# EAGLE design tally (EAGLE 9.6.2)
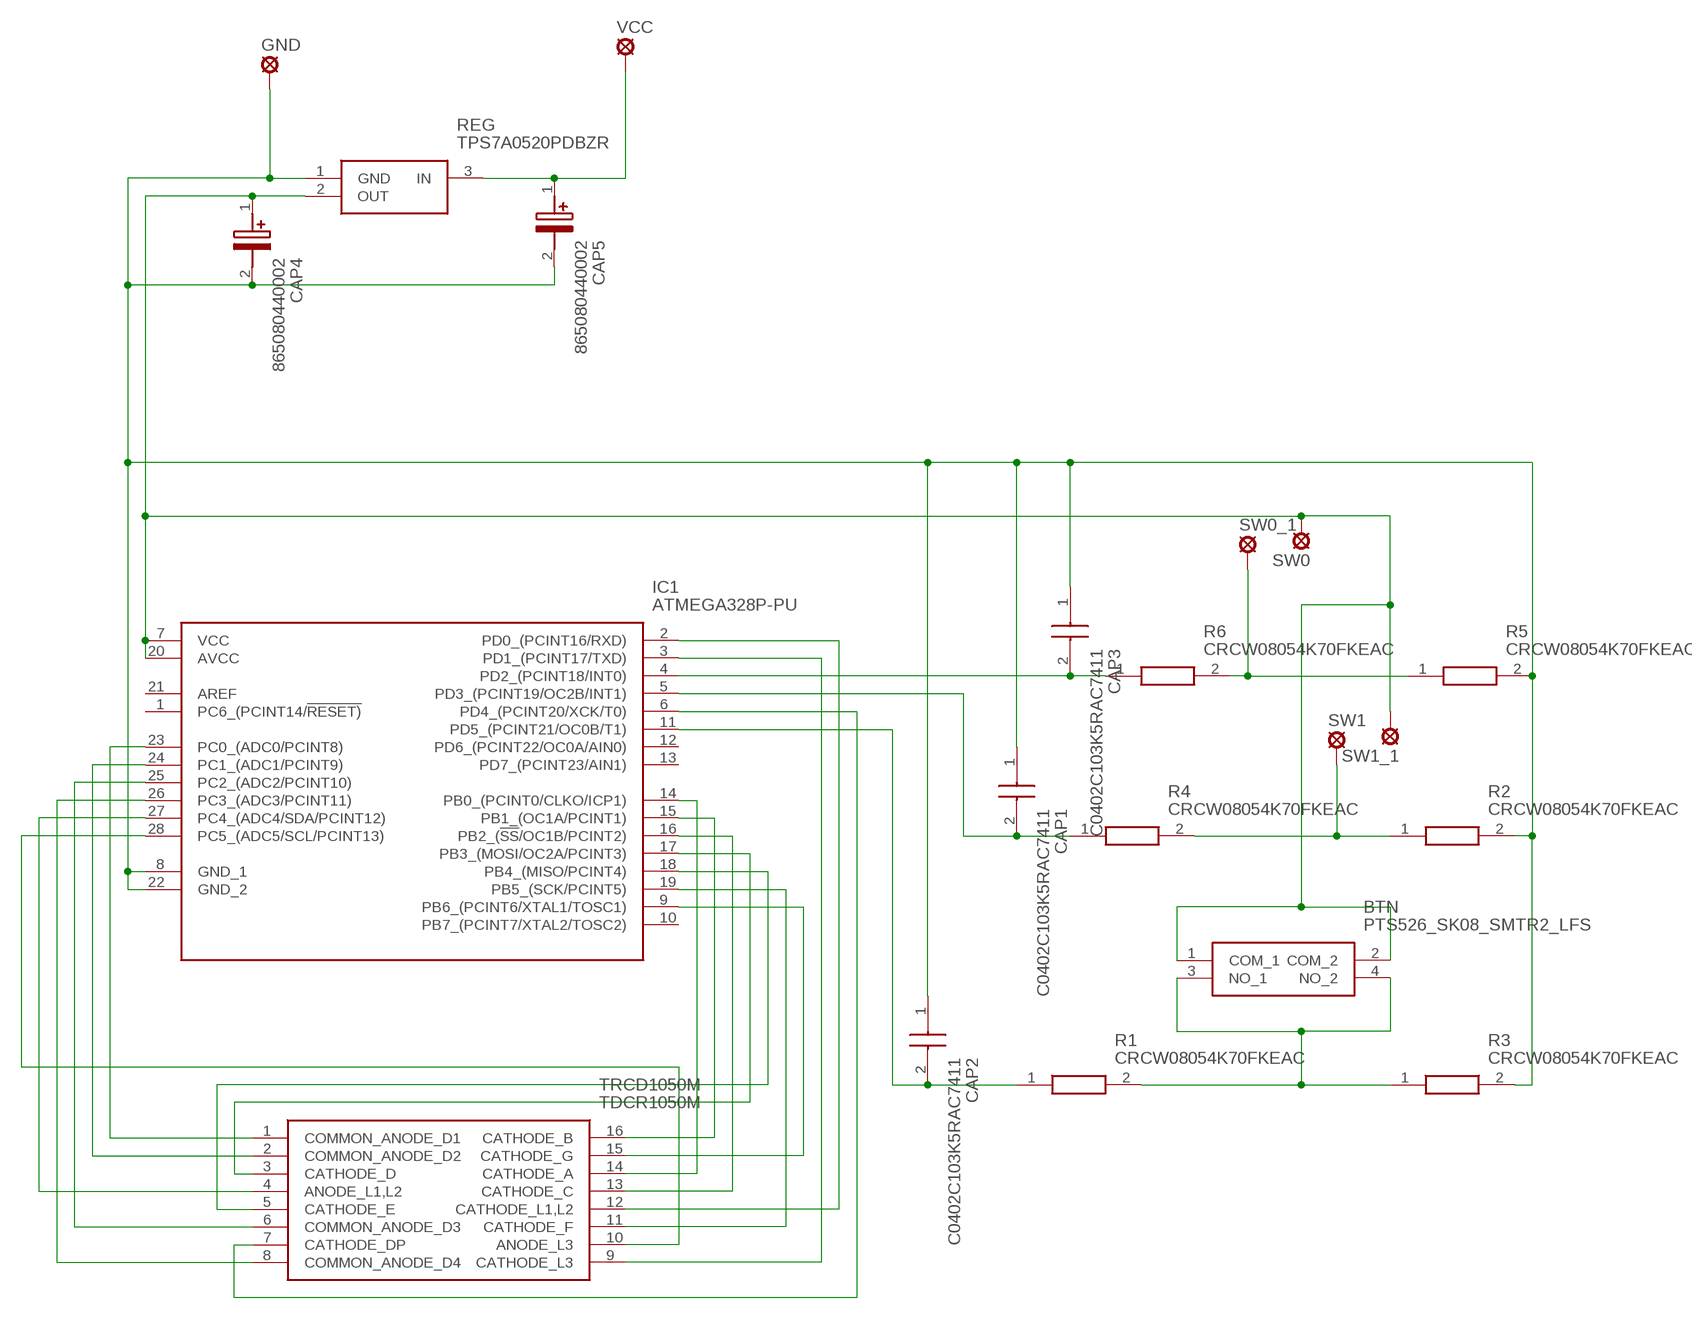
[diagram p0: schematic, sheet 1]

## Parts
BTN  PTS526_SK08_SMTR2_LFS  [PTS526SKG15SMTR2LFS]
CAP1  C0402C103K5RAC7411  [CAPC1005X55N]
CAP2  C0402C103K5RAC7411  [CAPC1005X55N]
CAP3  C0402C103K5RAC7411  [CAPC1005X55N]
CAP4  865080440002  [CAPAE400X550N]
CAP5  865080440002  [CAPAE400X550N]
GND  LSP11  [LSP11]
IC1  ATMEGA328P-PU  [DIP794W53P254L3467H457Q28N]
R1  CRCW08054K70FKEAC  [RESC2012X60N]
R2  CRCW08054K70FKEAC  [RESC2012X60N]
R3  CRCW08054K70FKEAC  [RESC2012X60N]
R4  CRCW08054K70FKEAC  [RESC2012X60N]
R5  CRCW08054K70FKEAC  [RESC2012X60N]
R6  CRCW08054K70FKEAC  [RESC2012X60N]
REG  TPS7A0520PDBZR  [SOT95P237X112-3N]
SW0  LSP11  [LSP11]
SW0_1  LSP11  [LSP11]
SW1  LSP11  [LSP11]
SW1_1  LSP11  [LSP11]
TRCD1050M  TDCR1050M  [DIPS1016W50P254L4020H725Q16N]
VCC  LSP11  [LSP11]

## Nets
N$1: CAP1.1 CAP2.1 CAP3.1 CAP4.2(-) CAP5.2(-) GND.MP IC1.8(GND_1) IC1.22(GND_2) R2.2 R3.2 R5.2 REG.1(GND)
N$2: CAP5.1(+) REG.3(IN) VCC.MP
N$4: IC1.14(PB0_(PCINT0/CLKO/ICP1)) TRCD1050M.14(CATHODE_A)
N$5: IC1.15(PB1_(OC1A/PCINT1)) TRCD1050M.16(CATHODE_B)
N$6: IC1.16(PB2_(!SS!/OC1B/PCINT2)) TRCD1050M.13(CATHODE_C)
N$7: IC1.17(PB3_(MOSI/OC2A/PCINT3)) TRCD1050M.3(CATHODE_D)
N$8: IC1.18(PB4_(MISO/PCINT4)) TRCD1050M.5(CATHODE_E)
N$9: IC1.19(PB5_(SCK/PCINT5)) TRCD1050M.11(CATHODE_F)
N$10: IC1.9(PB6_(PCINT6/XTAL1/TOSC1)) TRCD1050M.15(CATHODE_G)
N$11: IC1.23(PC0_(ADC0/PCINT8)) TRCD1050M.1(COMMON_ANODE_D1)
N$12: IC1.24(PC1_(ADC1/PCINT9)) TRCD1050M.2(COMMON_ANODE_D2)
N$13: IC1.25(PC2_(ADC2/PCINT10)) TRCD1050M.6(COMMON_ANODE_D3)
N$14: IC1.26(PC3_(ADC3/PCINT11)) TRCD1050M.8(COMMON_ANODE_D4)
N$15: IC1.27(PC4_(ADC4/SDA/PCINT12)) TRCD1050M.4(ANODE_L1,L2)
N$16: IC1.28(PC5_(ADC5/SCL/PCINT13)) TRCD1050M.10(ANODE_L3)
N$17: IC1.2(PD0_(PCINT16/RXD)) TRCD1050M.12(CATHODE_L1,L2)
N$18: IC1.3(PD1_(PCINT17/TXD)) TRCD1050M.9(CATHODE_L3)
N$19: IC1.6(PD4_(PCINT20/XCK/T0)) TRCD1050M.7(CATHODE_DP)
N$20: R5.1 R6.2 SW0_1.MP
N$21: CAP3.2 IC1.4(PD2_(PCINT18/INT0)) R6.1
N$22: CAP1.2 IC1.5(PD3_(PCINT19/OC2B/INT1)) R4.1
N$23: R2.1 R4.2 SW1.MP
N$24: CAP2.2 IC1.11(PD5_(PCINT21/OC0B/T1)) R1.1
N$26: BTN.1(COM_1) BTN.2(COM_2) CAP4.1(+) IC1.7(VCC) IC1.20(AVCC) REG.2(OUT) SW0.MP SW1_1.MP
N$27: BTN.3(NO_1) BTN.4(NO_2) R1.2 R3.1
Unconnected: IC1.1(PC6_(PCINT14/!RESET)) IC1.10(PB7_(PCINT7/XTAL2/TOSC2)) IC1.12(PD6_(PCINT22/OC0A/AIN0)) IC1.13(PD7_(PCINT23/AIN1)) IC1.21(AREF)

## Library data of the parts
BTN = SamacSys_Parts:PTS526_SK08_SMTR2_LFS: Tactile Switches 50mA 12VDC, 5.2x5.2mm, 0.8mm H, 260gf, G leads, No ground pin, no actuator Source: Datasheet <https://www.ckswitches.com/media/2780/pts526.pdf>; DESCRIPTION: Tactile Switches 50mA 12VDC, 5.2x5.2mm, 0.8mm H, 260gf, G leads, No ground pin, no actuator; HEIGHT: 1.6mm; MANUFACTURER_NAME: C & K COMPONENTS; MANUFACTURER_PART_NUMBER: PTS526 SK08 SMTR2 LFS; MOUSER_PART_NUMBER: 611-PTS526SK08SMTR2L; MOUSER_PRICE-STOCK: https://www.mouser.co.uk/ProductDetail/CK/PTS526-SK08-SMTR2-LFS?qs=UXgszm6BlbECw%2FyKtIWLXA%3D%3D
CAP1-CAP3 = SamacSys_Parts:C0402C103K5RAC7411: KEMET C0402C103K5RAC7411 10nF MLCC 50V dc +/-10% Tolerance SMD Source: Datasheet <https://ms.componentsearchengine.com/Datasheets/1/C0402C103K5RAC7411.pdf>; DESCRIPTION: KEMET C0402C103K5RAC7411 10nF MLCC 50V dc +/-10% Tolerance SMD; HEIGHT: 0.55mm; MANUFACTURER_NAME: Kemet; MANUFACTURER_PART_NUMBER: C0402C103K5RAC7411; MOUSER_PART_NUMBER: 80-C0402C103K5R7411; MOUSER_PRICE-STOCK: https://www.mouser.co.uk/ProductDetail/KEMET/C0402C103K5RAC7411?qs=pp%2FXe%252B1It%2FXjIsxZQe1n3w%3D%3D
CAP4 CAP5 = SamacSys_Parts:865080440002: Wurth Elektronik 10uF 25 V dc Aluminium Electrolytic Capacitor, WCAP-ASLI Series 2000h 4 (Dia.) x 5.35mm Source: Datasheet <https://katalog.we-online.com/pbs/datasheet/865080440002.pdf>; DESCRIPTION: Wurth Elektronik 10uF 25 V dc Aluminium Electrolytic Capacitor, WCAP-ASLI Series 2000h 4 (Dia.) x 5.35mm; HEIGHT: 5.5mm; MANUFACTURER_NAME: Wurth Elektronik; MANUFACTURER_PART_NUMBER: 865080440002; MOUSER_PART_NUMBER: 710-865080440002; MOUSER_PRICE-STOCK: https://www.mouser.co.uk/ProductDetail/Wurth-Elektronik/865080440002?qs=0KOYDY2FL2%2FXvxJ7qSnXzw%3D%3D
GND SW0 SW0_1 SW1 SW1_1 VCC = solpad:LSP11: SOLDER PAD drill 1.1 mm
IC1 = SamacSys_Parts:ATMEGA328P-PU: MICROCHIP - ATMEGA328P-PU. - MICROCONTROLLER MCU, 8 BIT, ATMEGA, 20MHZ, DIP-28 Source: Datasheet <http://ww1.microchip.com/downloads/en/DeviceDoc/Atmel-42735-8-bit-AVR-Microcontroller-ATmega328-328P_Datasheet.pdf>; DESCRIPTION: MICROCHIP - ATMEGA328P-PU. - MICROCONTROLLER MCU, 8 BIT, ATMEGA, 20MHZ, DIP-28; HEIGHT: 4.572mm; MANUFACTURER_NAME: Microchip; MANUFACTURER_PART_NUMBER: ATMEGA328P-PU; MOUSER_PART_NUMBER: 556-ATMEGA328P-PU; MOUSER_PRICE-STOCK: https://www.mouser.co.uk/ProductDetail/Microchip-Technology-Atmel/ATMEGA328P-PU?qs=K8BHR703ZXguOQv3sKbWcg%3D%3D
R1-R6 = SamacSys_Parts:CRCW08054K70FKEAC: Thick Film Resistors - SMD 1/8Watt 4.7Kohms 1% Commercial Use Source: Datasheet; DESCRIPTION: Thick Film Resistors - SMD 1/8Watt 4.7Kohms 1% Commercial Use; HEIGHT: 0.6mm; MANUFACTURER_NAME: Vishay; MANUFACTURER_PART_NUMBER: CRCW08054K70FKEAC; MOUSER_PART_NUMBER: 71-CRCW08054K70FKEAC; MOUSER_PRICE-STOCK: https://www.mouser.co.uk/ProductDetail/Vishay-Dale/CRCW08054K70FKEAC?qs=E3Y5ESvWgWOQAAVugewEHA%3D%3D
REG = SamacSys_Parts:TPS7A0520PDBZR: 1-A, ultra-low-IQ, 200-mA low-dropout (LDO) regulator in a small-sized package Source: Datasheet <https://www.ti.com/lit/gpn/TPS7A05>; DESCRIPTION: 1-A, ultra-low-IQ, 200-mA low-dropout (LDO) regulator in a small-sized package; HEIGHT: 1.12mm; MANUFACTURER_NAME: Texas Instruments; MANUFACTURER_PART_NUMBER: TPS7A0520PDBZR; MOUSER_PART_NUMBER: 595-TPS7A0520PDBZR; MOUSER_PRICE-STOCK: https://www.mouser.co.uk/ProductDetail/Texas-Instruments/TPS7A0520PDBZR?qs=XeJtXLiO41S12gnuxaHGgQ%3D%3D
TRCD1050M = SamacSys_Parts:TDCR1050M: LED Displays & Accessories 7-Seg Clock module 10mm red m.plex c.a. Source: Datasheet <https://www.vishay.com/docs/83180/tdcx10x0m.pdf>; DESCRIPTION: LED Displays & Accessories 7-Seg Clock module 10mm red m.plex c.a.; HEIGHT: 7.25mm; MANUFACTURER_NAME: Vishay; MANUFACTURER_PART_NUMBER: TDCR1050M; MOUSER_PART_NUMBER: 78-TDCR1050M; MOUSER_PRICE-STOCK: https://www.mouser.co.uk/ProductDetail/Vishay-Semiconductors/TDCR1050M?qs=RzxYCzJDjPVEfTEFPHCLeg%3D%3D

## Board
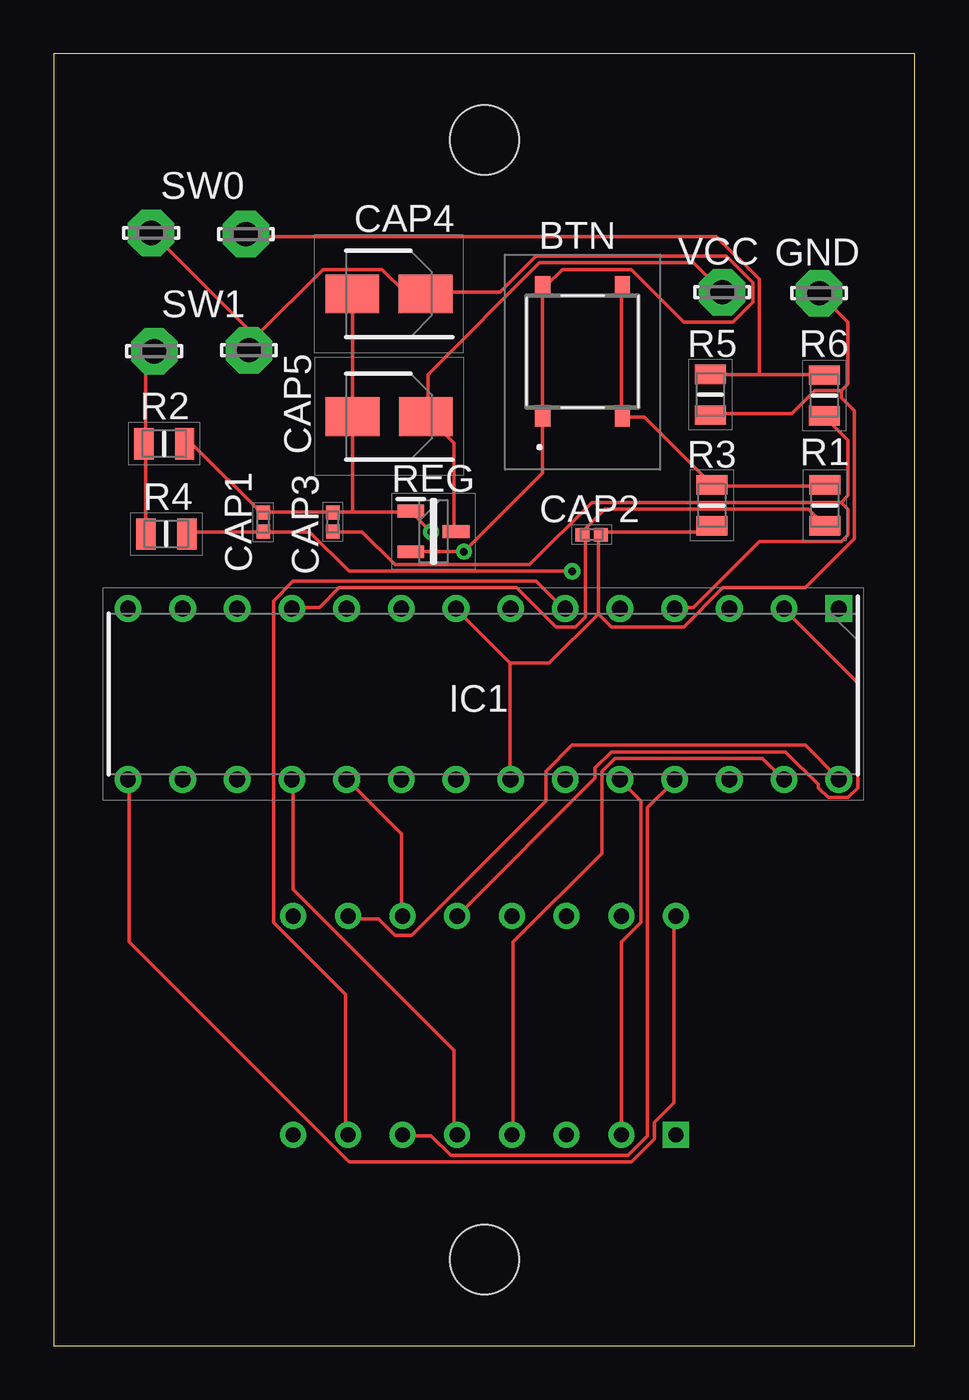
[diagram p1: board, top side]
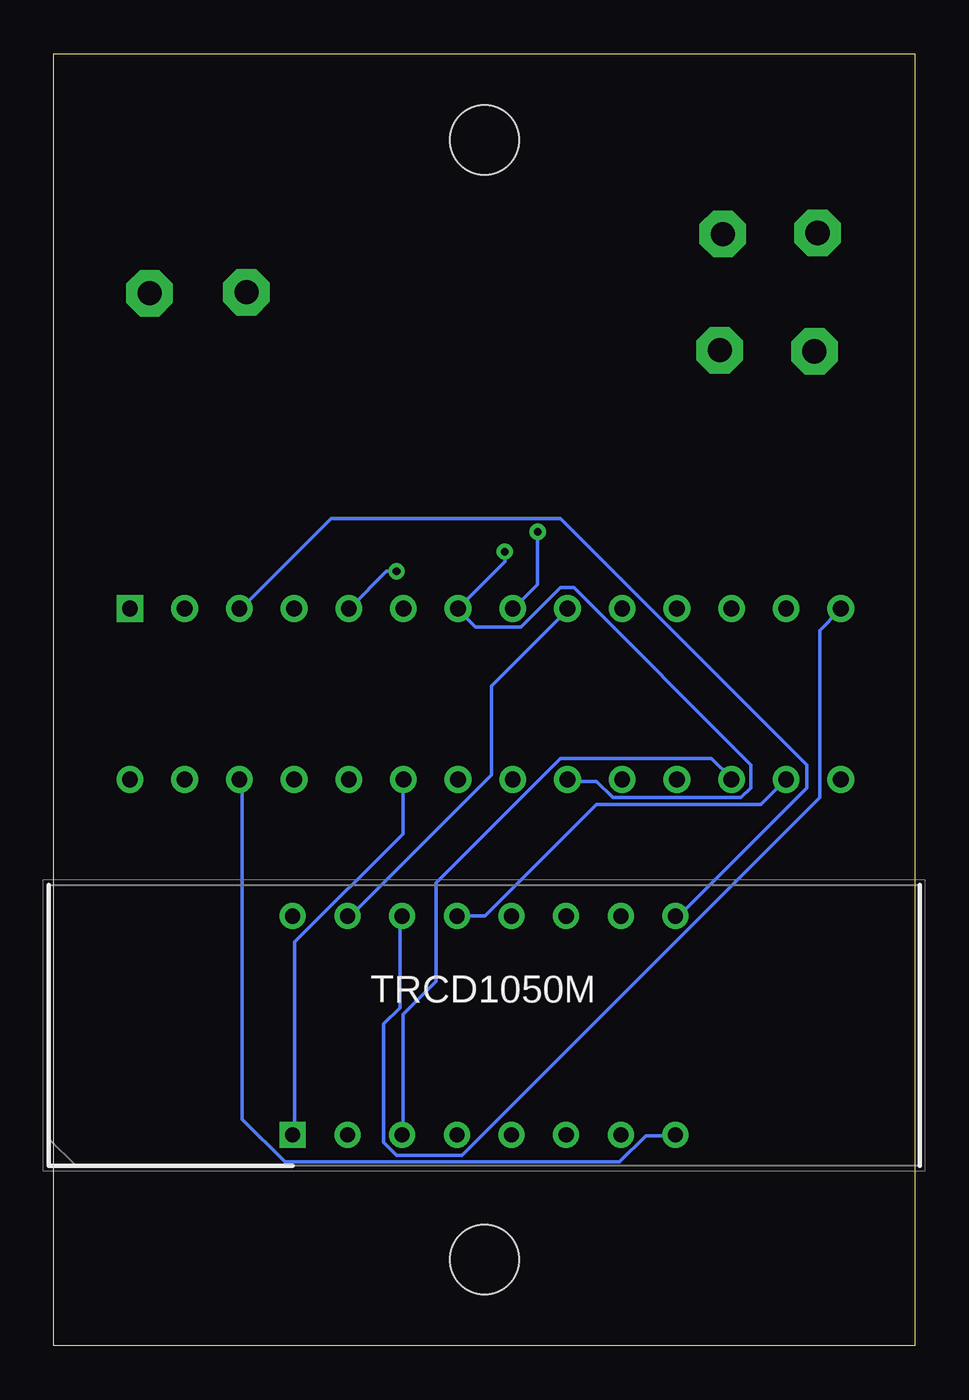
[diagram p2: board, bottom side, seen from below]

Size 40 x 60 mm. Coordinates in mm from the lower left corner, seen from the top.
Outline: 0,0 40,0 40,60 0,60 0,0
Copper layers (1*16): Top 0.035mm / dielectric 1.53mm / Bottom 0.035mm
Design rules "default *": minimum track width 6mil, minimum drill 0.35mm, track to track 6mil, track to pad 6mil, pad to pad 6mil, via to via 6mil, smd to smd 6mil, copper to edge 40mil, drill to drill 6mil, minimum pad ring 10mil, minimum via ring 8mil, stop-mask expansion 4mil, vias tented up to drill 0mil, thermal gap 10mil
Holes 3.2 mm at 20,4 20,56

### Footprints (pad centres in the part's own frame; a part is rotated, then mirrored left to right if it is on the bottom)
PTS526SKG15SMTR2LFS = smd 1 x 0.7: 1 -3,1.85; 2 3,1.85; 3 -3,-1.85; 4 3,-1.85
CAPC1005X55N = smd 0.65 x 0.62: 1 -0.44,0; 2 0.44,0
CAPAE400X550N = smd 2.5 x 1.8: 1 -1.7,0; 2 1.7,0
LSP11 = drill 1.118 pad 2.159 octagon: MP 0,0
DIP794W53P254L3467H457Q28N = drill 0.733 pad 1.133 square: 1 -3.969,16.51 | drill 0.733 pad 1.133: 2 -3.969,13.97; 3 -3.969,11.43; 4 -3.969,8.89; 5 -3.969,6.35; 6 -3.969,3.81; 7 -3.969,1.27; 8 -3.969,-1.27; 9 -3.969,-3.81; 10 -3.969,-6.35; 11 -3.969,-8.89; 12 -3.969,-11.43; 13 -3.969,-13.97; 14 -3.969,-16.51; 15 3.969,-16.51; 16 3.969,-13.97; 17 3.969,-11.43; 18 3.969,-8.89; 19 3.969,-6.35; 20 3.969,-3.81; 21 3.969,-1.27; 22 3.969,1.27; 23 3.969,3.81; 24 3.969,6.35; 25 3.969,8.89; 26 3.969,11.43; 27 3.969,13.97; 28 3.969,16.51
RESC2012X60N = smd 0.9 x 1.45: 1 -0.95,0; 2 0.95,0
SOT95P237X112-3N = smd 1.25 x 0.6: 1 -1.05,0.95; 2 -1.05,-0.95; 3 1.05,0
DIPS1016W50P254L4020H725Q16N = drill 0.7 pad 1.1 square: 1 0,0 | drill 0.7 pad 1.1: 2 0,-2.54; 3 0,-5.08; 4 0,-7.62; 5 0,-10.16; 6 0,-12.7; 7 0,-15.24; 8 0,-17.78; 9 10.16,-17.78; 10 10.16,-15.24; 11 10.16,-12.7; 12 10.16,-10.16; 13 10.16,-7.62; 14 10.16,-5.08; 15 10.16,-2.54; 16 10.16,0

### Placement (x,y rotation side)
BTN  24.56,46.18 90 top
CAP1  9.73,38.24 270 top
CAP2  24.98,37.67 180 top
CAP3  12.96,38.26 270 top
CAP4  15.56,48.85 180 top
CAP5  15.58,43.15 180 top
GND  35.55,48.88 0 top
IC1  19.95,30.27 270 top
R1  35.82,39.03 90 top
R2  5.13,41.89 0 top
R3  30.57,39.03 270 top
R4  5.23,37.7 180 top
R5  30.5,44.17 270 top
R6  35.79,44.13 90 top
REG  17.63,37.82 0 top
SW0  4.52,51.68 0 top
SW0_1  8.92,51.63 0 top
SW1  4.67,46.18 0 top
SW1_1  9.07,46.23 0 top
TRCD1050M  28.9,9.79 90 bottom
VCC  31.05,48.93 0 top

### Tracks (layer width: path | path; a pad name or v marks a point on that pad's centre or on a via)
N$1  (via drill 0.35)
  Top 0.152: 13.87,38.71 13.11,38.71 CAP3.1 9.75,38.71 CAP1.1 9.6,38.71 6.55,41.76 6.1,41.76 R2.2 | 13.87,38.71 16.46,38.71 REG.1 16.61,38.71 v17.53,37.8 | 13.87,38.71 13.87,43.13 CAP5.2 13.87,43.28 13.87,48.77 CAP4.2 | 36.58,44.35 35.36,44.35 34.29,43.28 30.63,43.28 R5.2 | 36.58,44.35 36.88,44.65 36.88,47.55 35.66,48.77 GND.MP | R3.2 30.48,37.95 30.33,37.8 25.45,37.8 CAP2.1 25.3,37.64 25.3,33.98 | 21.18,31.7 21.18,26.36 IC1.22 | 21.18,31.7 18.75,34.14 IC1.8 | 25.3,33.98 23.01,31.7 21.18,31.7 | 36.58,44.35 36.58,44.04 37.19,43.43 37.19,37.49 34.9,35.2 31.09,35.2 29.26,33.38 25.91,33.38 25.3,33.98
  Bottom 0.152: v17.53,37.8 17.53,35.36 18.59,34.29 IC1.8
N$2
  Top 0.152: REG.3 18.59,37.95 18.59,41.91 17.37,43.13 CAP5.1 17.37,43.28 17.37,45.11 22.55,50.29 29.72,50.29 30.94,49.07 VCC.MP
N$4
  Bottom 0.152: TRCD1050M.14 23.93,19.81 23.93,15.7 24.69,14.94 24.69,9.45 24.08,8.84 21.03,8.84 4.42,25.45 4.42,33.22 3.5,34.14 IC1.14
N$5
  Top 0.152: TRCD1050M.16 28.8,19.81 28.8,11.28 27.89,10.36 27.89,9.6 26.82,8.53 13.72,8.53 3.5,18.75 3.5,26.21 IC1.15
N$6
  Bottom 0.152: TRCD1050M.13 21.18,19.96 19.96,19.96 14.78,25.15 7.16,25.15 6.1,26.21 IC1.16
N$7
  Bottom 0.152: TRCD1050M.3 23.77,9.91 23.77,15.39 22.25,16.92 22.25,21.49 16.46,27.28 9.45,27.28 8.53,26.36 IC1.17
N$8
  Top 0.152: TRCD1050M.5 18.59,9.91 18.59,13.72 11.12,21.18 11.12,26.21 IC1.18
N$9
  Top 0.152: TRCD1050M.11 16.15,19.96 16.15,23.77 13.72,26.21 IC1.19
N$10
  Bottom 0.152: TRCD1050M.15 26.21,19.96 19.66,26.52 19.66,30.63 16.15,34.14 IC1.9
N$11
  Bottom 0.152: TRCD1050M.1 28.8,9.91 28.8,18.75 23.77,23.77 23.77,26.21 IC1.23
N$12
  Top 0.152: TRCD1050M.2 26.36,9.91 26.36,18.75 27.28,19.66 27.28,25.3 26.36,26.21 IC1.24
N$13
  Top 0.152: TRCD1050M.6 16.31,9.75 17.53,9.75 18.44,8.84 26.67,8.84 27.58,9.75 27.58,24.99 28.8,26.21 IC1.25
N$14
  Bottom 0.152: TRCD1050M.8 11.12,9.75 12.5,9.75 13.72,8.53 29.26,8.53 31.24,10.52 31.24,26.21 IC1.26
N$15
  Top 0.152: TRCD1050M.4 21.34,9.91 21.34,18.75 25.45,22.86 25.45,26.67 26.06,27.28 32.92,27.28 33.83,26.36 IC1.27
N$16
  Top 0.152: TRCD1050M.10 13.72,19.81 15.09,19.81 15.85,19.05 16.61,19.05 22.86,25.3 22.86,26.67 24.08,27.89 34.9,27.89 36.42,26.36 IC1.28
N$17
  Top 0.152: TRCD1050M.12 18.75,19.96 25.15,26.36 25.15,26.82 25.91,27.58 33.98,27.58 35.51,26.06 35.51,25.91 35.97,25.45 36.88,25.45 37.34,25.91 37.34,30.79 33.98,34.14 IC1.2
N$18
  Bottom 0.152: TRCD1050M.9 10.97,19.96 5.03,25.91 5.03,26.98 16.46,38.41 27.13,38.41 31.24,34.29 IC1.3
N$19
  Top 0.152: TRCD1050M.7 13.56,9.91 13.56,16.31 10.21,19.66 10.21,34.59 11.12,35.51 22.4,35.51 23.62,34.29 IC1.6
N$20
  Top 0.152: 32.77,45.11 30.63,45.11 R5.1 | 32.77,45.11 35.66,45.11 R6.2 | 32.77,45.11 32.77,49.53 30.79,51.51 8.99,51.51 SW0_1.MP
N$21
  Top 0.152: 36.58,39.17 24.99,39.17 22.1,36.27 15.85,36.27 14.33,37.8 13.11,37.8 CAP3.2 | 36.58,39.17 36.88,39.47 36.88,42.06 35.81,43.13 R6.1 | 36.58,39.17 36.88,38.86 36.88,37.64 36.58,37.34 32.77,37.34 29.72,34.29 28.96,34.29 IC1.4
N$22  (via drill 0.35)
  Top 0.152: R4.1 6.25,37.8 9.6,37.8 CAP1.2 9.75,37.8 11.89,37.8 13.72,35.97 v24.08,35.97
  Bottom 0.152: v24.08,35.97 24.54,35.97 26.21,34.29 IC1.5
N$23
  Top 0.152: R4.2 4.27,37.8 4.27,41.76 R2.1 4.27,41.91 4.27,45.87 4.57,46.18 SW1.MP
N$24
  Top 0.152: R1.1 35.81,38.1 35.05,38.86 25.6,38.86 24.69,37.95 24.69,37.8 CAP2.2 24.69,37.64 24.69,33.83 24.23,33.38 23.32,33.38 21.49,35.2 13.26,35.2 12.34,34.29 11.12,34.29 IC1.11
N$26  (via drill 0.35)
  Top 0.152: 9.45,46.94 9.14,46.63 9.14,46.33 SW1_1.MP 9.45,46.94 | 9.45,46.94 12.5,49.99 15.24,49.99 16.31,48.92 17.22,48.92 CAP4.1 17.37,48.92 20.73,48.92 22.4,50.6 31.24,50.6 32.46,49.38 32.46,48.46 31.55,47.55 29.26,47.55 26.82,49.99 23.62,49.99 22.86,49.23 BTN.2 22.71,49.07 22.71,43.28 BTN.1 22.71,43.13 22.71,40.54 v19.05,36.88 16.61,36.88 REG.2 | 9.45,46.94 9.3,46.94 4.57,51.66 SW0.MP
  Bottom 0.152: IC1.20 16,26.21 14.78,26.21 14.02,25.45 8.08,25.45 7.62,25.91 7.62,26.98 15.85,35.2 16.46,35.2 18.29,33.38 20.42,33.38 21.18,34.14 IC1.7 21.18,34.29 19.05,36.42 v19.05,36.88
N$27
  Top 0.152: BTN.4 26.36,49.07 26.36,43.28 BTN.3 26.52,43.13 27.43,43.13 30.48,40.08 R3.1 30.63,39.93 35.81,39.93 R1.2